# Altium project pwm-tl494-smd.PrjPcb
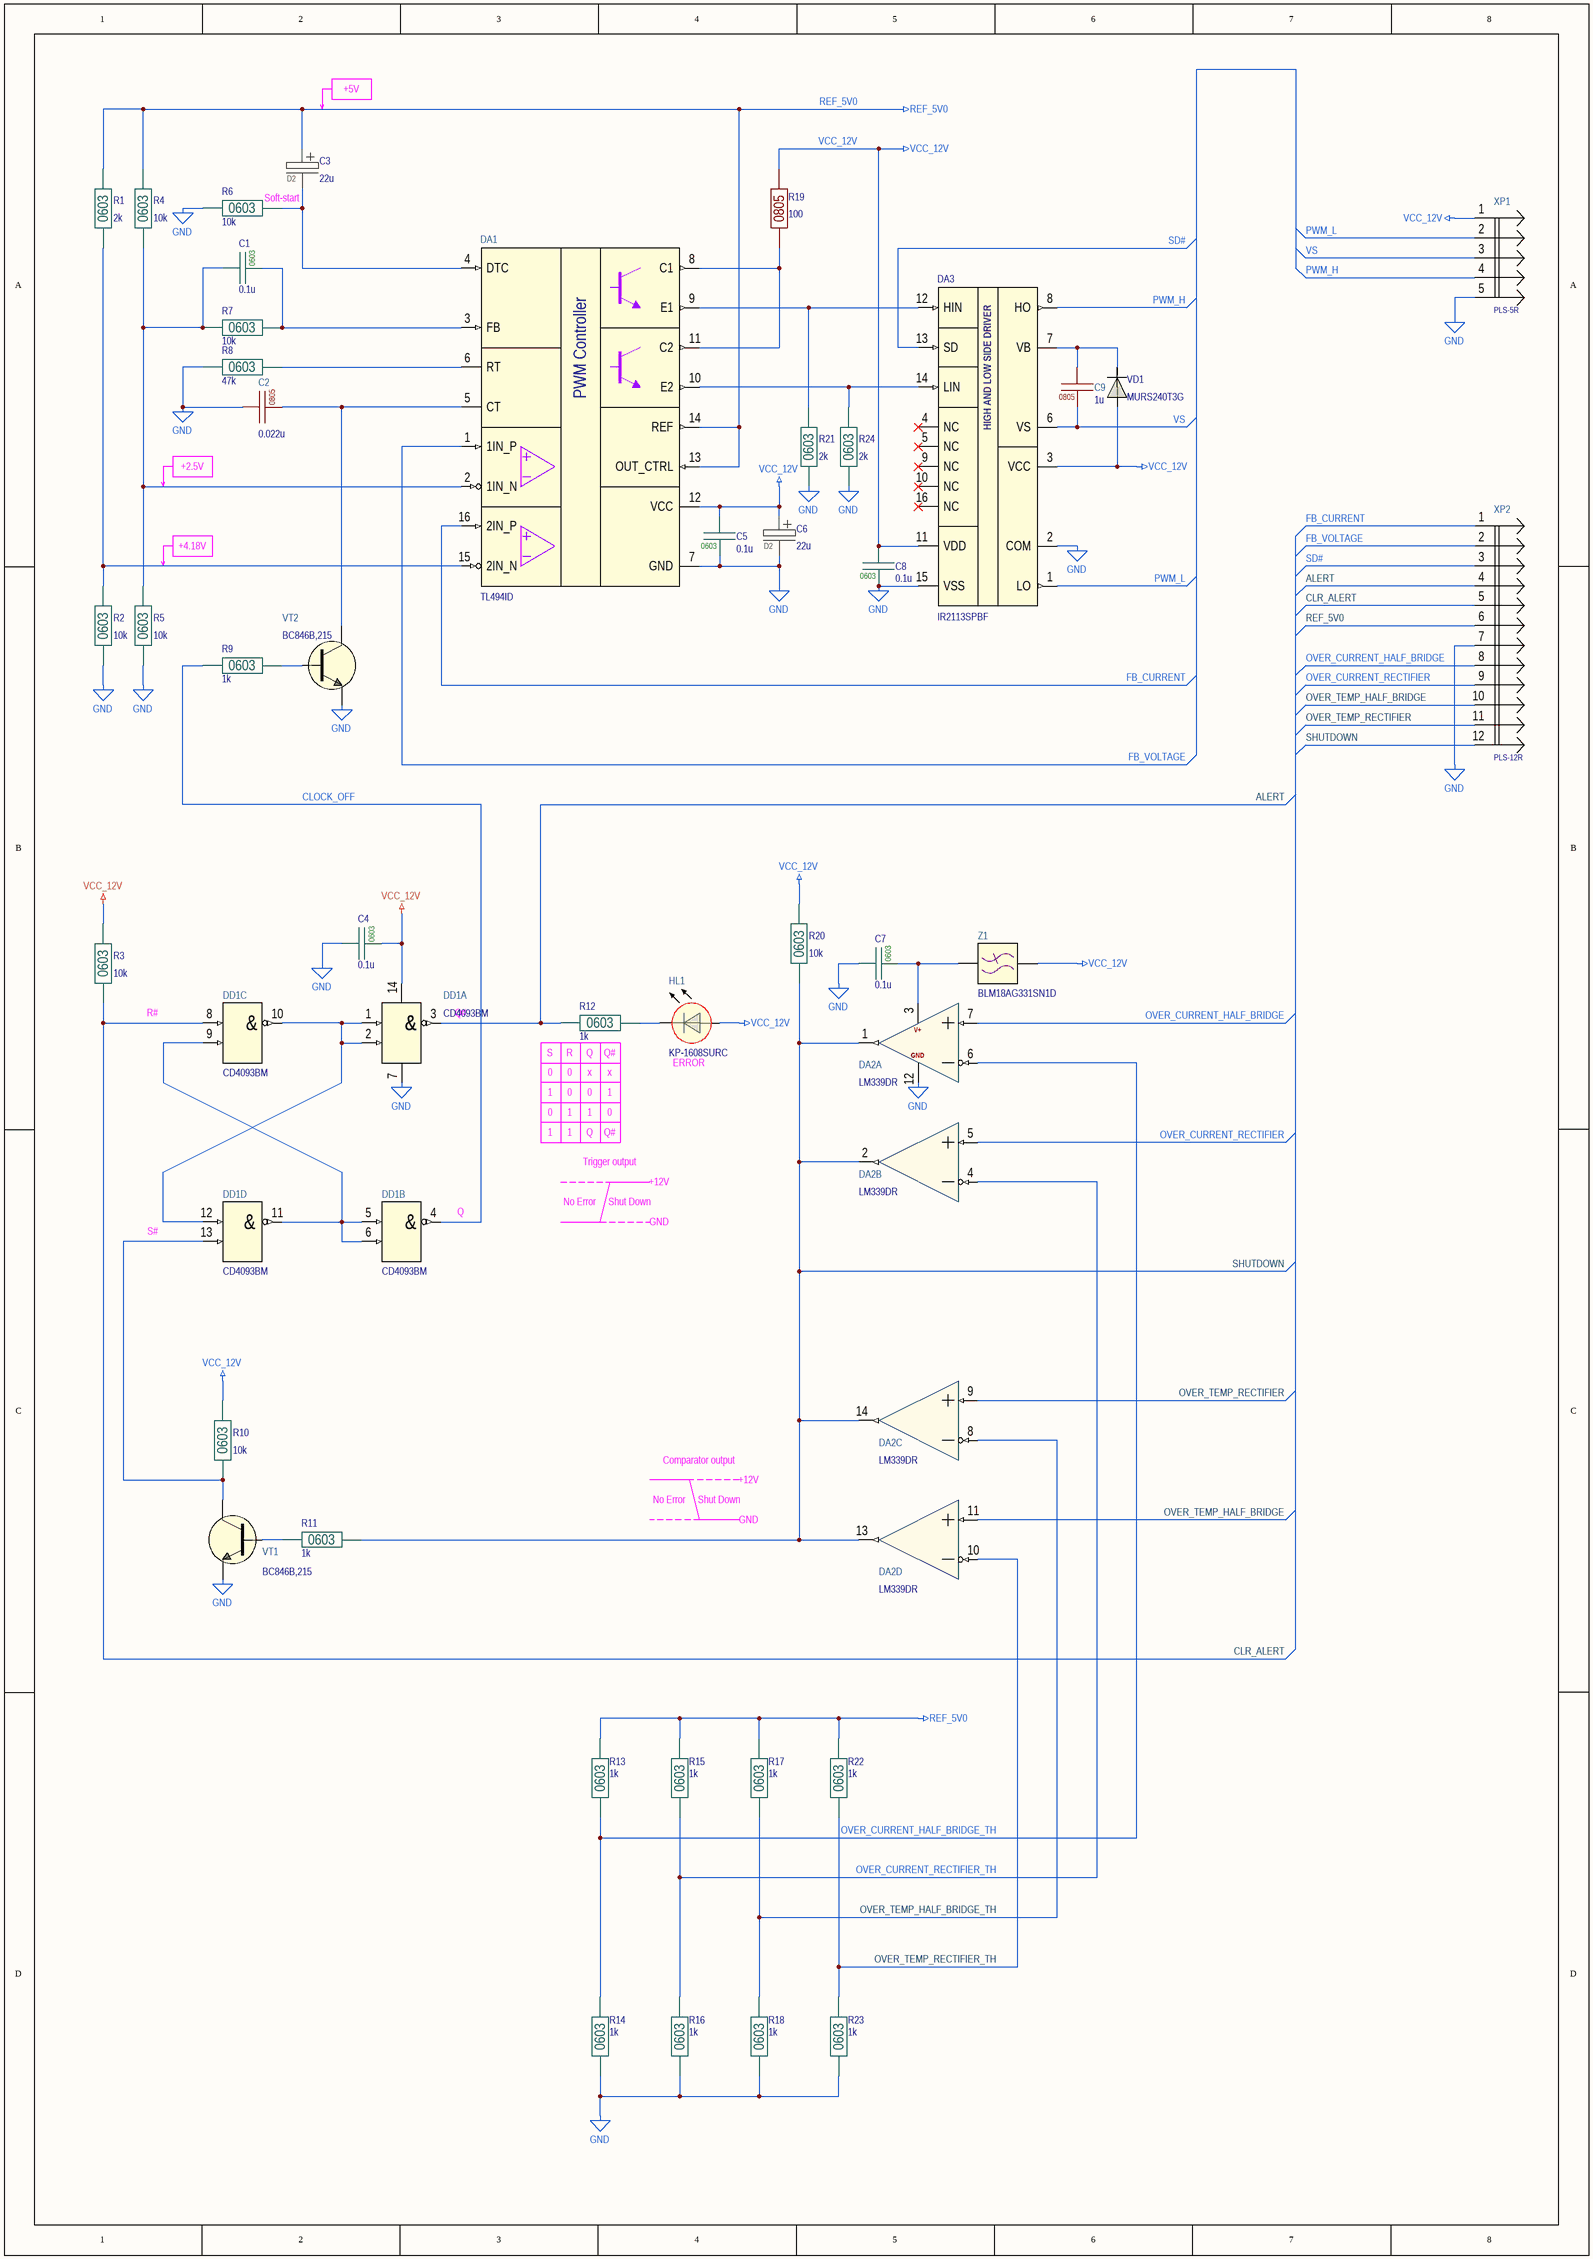
[diagram p0: pwm-tl494-smd.SchDoc]
1 sheet, 44 parts. Net scope: global (net labels, ports and power ports of the same name join across sheets).
Board file: pwm-tl494-smd.PcbDoc

## Sheet pwm-tl494-smd.SchDoc
size A2 portrait; Organization: Protel International P/L; Address1: L3, 12a Rodborough Rd; Address2: Frenchs Forest; Address3: NSW; Address4: Australia 2086

### Parts
C1  0.1u  Package: 0603  [CAP0603]
C2  0.022u  Package: 0805  [CAP0805-0.95]
C3  22u  Package: D2  [CAP_TQC_D2]
C4  0.1u  Package: 0603  [CAP0603]
C5  0.1u  Package: 0603  [CAP0603]
C6  22u  Package: D2  [CAP_TQC_D2]
C7  0.1u  Package: 0603  [CAP0603]
C8  0.1u  Package: 0603  [CAP0603]
C9  1u  Package: 0805  [CAP0805-1.35]
DA1  TL494ID  [SOIC-16]
DA2  LM339DR  [SOIC-14]  (parts A,B,C,D of 4)
DA3  IR2113SPBF  [SO-16W]
DD1  CD4093BM  [SOIC-14]  (parts A,B,C,D of 4)
HL1  KP-1608SURC  [LED0603R]
R1  2k  Package: 0603  [RES0603B]
R2  10k  Package: 0603  [RES0603B]
R3  10k  Package: 0603  [RES0603B]
R4  10k  Package: 0603  [RES0603B]
R5  10k  Package: 0603  [RES0603B]
R6  10k  Package: 0603  [RES0603B]
R7  10k  Package: 0603  [RES0603B]
R8  47k  Package: 0603  [RES0603B]
R9  1k  Package: 0603  [RES0603B]
R10  10k  Package: 0603  [RES0603B]
R11  1k  Package: 0603  [RES0603B]
R12  1k  Package: 0603  [RES0603B]
R13  1k  Package: 0603  [RES0603B]
R14  1k  Package: 0603  [RES0603B]
R15  1k  Package: 0603  [RES0603B]
R16  1k  Package: 0603  [RES0603B]
R17  1k  Package: 0603  [RES0603B]
R18  1k  Package: 0603  [RES0603B]
R19  100  Package: 0805  [RES0805B]
R20  10k  Package: 0603  [RES0603B]
R21  2k  Package: 0603  [RES0603B]
R22  1k  Package: 0603  [RES0603B]
R23  1k  Package: 0603  [RES0603B]
R24  2k  Package: 0603  [RES0603B]
VD1  MURS240T3G  [SMB]
VT1  BC846B,215  [SOT23-3]
VT2  BC846B,215  [SOT23-3]
XP1  PLS-5R  [PLS-5R]
XP2  PLS-12R  [PLS-12R]
Z1  BLM18AG331SN1D  [BLM0603P]

### Nets
GND: C2.1 C4.2 C5.1 C6.2 C7.2 C8.1 DA1.7(GND) DA2.12(GND) DA3.2(COM) DA3.15(VSS) DD1.7(GND) R2.1 R5.1 R6.2 R8.2 R14.2 R16.2 R18.2 R21.1 R23.2 R24.1 VT1.2(E) VT2.2(E) XP1.5 XP2.7
REF_5V0: C3.1 DA1.13(OUT_CTRL) DA1.14(REF) R1.2 R4.2 R13.1 R15.1 R17.1 R22.1 XP2.6
VCC_12V: C4.1 C5.2 C6.1 C8.2 DA1.12(VCC) DA3.3(VCC) DA3.11(VDD) DD1.14(VCC) HL1.2 R3.2 R10.2 R19.2 R20.2 VD1.2(A) XP1.1 Z1.2
ALERT: DD1.3(Y0) R12.2 XP2.4
CLOCK_OFF: DD1.4(Y1) R9.2
CLR_ALERT: DD1.8(A2) R3.1 XP2.5
FB_CURRENT: DA1.16(2IN_P) XP2.1
FB_VOLTAGE: DA1.1(1IN_P) XP2.2
OVER_CURRENT_HALF_BRIDGE: DA2.7(1IN+) XP2.8
OVER_CURRENT_HALF_BRIDGE_TH: DA2.6(1IN-) R13.2 R14.1
OVER_CURRENT_RECTIFIER: DA2.5(2IN+) XP2.9
OVER_CURRENT_RECTIFIER_TH: DA2.4(2IN-) R15.2 R16.1
OVER_TEMP_HALF_BRIDGE: DA2.11(4IN+) XP2.10
OVER_TEMP_HALF_BRIDGE_TH: DA2.8(3IN-) R17.2 R18.1
OVER_TEMP_RECTIFIER: DA2.9(3IN+) XP2.11
OVER_TEMP_RECTIFIER_TH: DA2.10(4IN-) R22.2 R23.1
PWM_H: DA3.8(HO) XP1.4
PWM_L: DA3.1(LO) XP1.2
SD#: DA3.13(SD) XP2.3
SHUTDOWN: DA2.1(1OUT) DA2.2(2OUT) DA2.13(4OUT) DA2.14(3OUT) R11.1 R20.1 XP2.12
VS: C9.1 DA3.6(VS) XP1.3
NetC1_1: C1.1 DA1.3(FB) R7.1
NetC1_2: C1.2 DA1.2(1IN_N) R4.1 R5.2 R7.2
NetC2_2: C2.2 DA1.5(CT) VT2.3(C)
NetC3_2: C3.2 DA1.4(DTC) R6.1
NetC7_1: C7.1 DA2.3(VCC) Z1.1
NetC9_2: C9.2 DA3.7(VB) VD1.1(C)
NetDA1_6: DA1.6(RT) R8.1
NetDA1_8: DA1.8(C1) DA1.11(C2) R19.1
NetDA1_9: DA1.9(E1) DA3.12(HIN) R21.2
NetDA1_10: DA1.10(E2) DA3.14(LIN) R24.2
NetDA1_15: DA1.15(2IN_N) R1.1 R2.2
NetDD1_1: DD1.1(A0) DD1.2(B0) DD1.10(Y2) DD1.12(A3)
NetDD1_5: DD1.5(A1) DD1.6(B1) DD1.9(B2) DD1.11(Y3)
NetDD1_13: DD1.13(B3) R10.1 VT1.3(C)
NetHL1_1: HL1.1 R12.1
NetR9_1: R9.1 VT2.1(B)
NetR11_2: R11.2 VT1.1(B)

Not connected (* = marked no-connect by the designer): DA3 4(NC)* 5(NC)* 9(NC)* 10(NC)* 16(NC)*

### Notes on the sheet
- +5V
- (near R6) Soft-start
- +2.5V
- +4.18V
- R#
- (near DD1) Q#
- (near R12) S
- (near R12) R
- (near R12) Q
- (near R12) Q#
- (near HL1) ERROR
- 0
- 1
- x
- Q
- Q#
- Trigger output
- (near DD1) Q
- No Error
- Shut Down
- +12V
- S#
- GND
- Comparator output
- Title
- Size:
- Date:
- A3
- Number:
- Time:
- Revision:
- Sheet
- of
- File:
- (in symbol CD4093BM, part A) &
- (in symbol CD4093BM, part B) &
- (in symbol CD4093BM, part C) &
- (in symbol CD4093BM, part D) &
- (in symbol LM339DR, part A) V+
- (in symbol TL494ID) PWM Controller

### Library data of the parts
C1 C4 C5 C7 C8 = C0603: Capacitors 0603 package case; Part Number: CL10B104KB8NNNC; Manufacturer: Samsung Sdi Co. Ltd; Tolerance: ± 10 %; Dielectric: X7R; Voltage: 50V; Value: 0.1u; Value on schem: 0.1u
C2 = C0805: Capacitors 0805 package case; Part Number: CL21C222JBFNNNG; Manufacturer: SAMSUNG; Tolerance: ± 5 %; Dielectric: NP0; Voltage: 50V; Value: 0.022u; Value on schem: 0.022u
C3 C6 = C_TQC_D2: Conductive Polymer Tantalum Solid Capacitors TQC-Series. Case code D2; Part Number: 25TQC22MV; Manufacturer: Matsushita; Tolerance: ± 20 %; Voltage: 25V; Value: 22u; Value on schem: 22u
C9 = C0805: Capacitors 0805 package case; Part Number: CL21B105KBFNNNE; Manufacturer: SAMSUNG; Tolerance: ± 10 %; Dielectric: X7R; Voltage: 50V; Value: 1u; Value on schem: 1u
DA1 = TL494ID: Pulse-Width-Modulation Control Circuits; Manufacturer: Texas Instruments; Part Number: TL494ID; Package: SOIC-16
DA2 = LM339DR: Quad Comparators; Manufacturer: Texas Instruments; Part Number: LM339DR; Package: SOIC-14
DA3 = IR2113SPBF: HIGH AND LOW SIDE DRIVER; Manufacturer: International Rectifier; Part Number: IR2113SPBF; Package: SO-16W
DD1 = CD4093BM: Quad 2-Input NAND Gate Schmitt Triggers; Manufacturer: Texas Instruments; Part Number: CD4093BM; Package: SOIC-14
HL1 = KP-1608SURC: Hyper red led (package case 0603); Manufacturer: Kingbright Company LLC.; Designator: HL*; Package: 0603; Part Number: KP-1608SURC; Color: Hyper red
R1 R21 R24 = R0603: Resistor 0603 package case; Part Number: RC0603FR-072KL; Manufacturer: Yageo; Tolerance: ± 1 %; Value: 2k; Value on schem: 2k
R2-R7 R10 R20 = R0603: Resistor 0603 package case; Part Number: RC0603FR-0710KL; Manufacturer: Yageo; Tolerance: ± 1 %; Value: 10k; Value on schem: 10k
R8 = R0603: Resistor 0603 package case; Part Number: RC0603FR-0747KL; Manufacturer: Yageo; Tolerance: ± 1 %; Value: 47k; Value on schem: 47k
R9 R11-R18 R22 R23 = R0603: Resistor 0603 package case; Part Number: RC0603FR-071KL; Manufacturer: Yageo; Tolerance: ± 1 %; Value: 1k; Value on schem: 1k
R19 = R0805: Resistor 0805 package case; Part Number: RC0805FR-07100RL; Manufacturer: Yageo; Tolerance: ± 1 %; Voltage: 150V; Temperature Coefficient: ±100ppm/°C; Value: 100; Value on schem: 100
VD1 = MURS240T3G: Diode 400V, 2A; Manufacturer: ON Semiconductor; Package: DO-214AA, SMB; Part Number: MURS240T3G
VT1 VT2 = BC846B,215: General Purpose n-p-n Transistors; Manufacturer: Nexperia USA Inc.; Package: SOT23-3; Part Number: BC846B,215
Z1 = BLM18AG331SN1D: Power line filter, imperdance 330 Ohm (current 05A); Part Number: BLM18AG331SN1D; Package: 0603
XP1 = PLS-5R: Value: PLS-5R
XP2 = PLS-12R: Value: PLS-12R